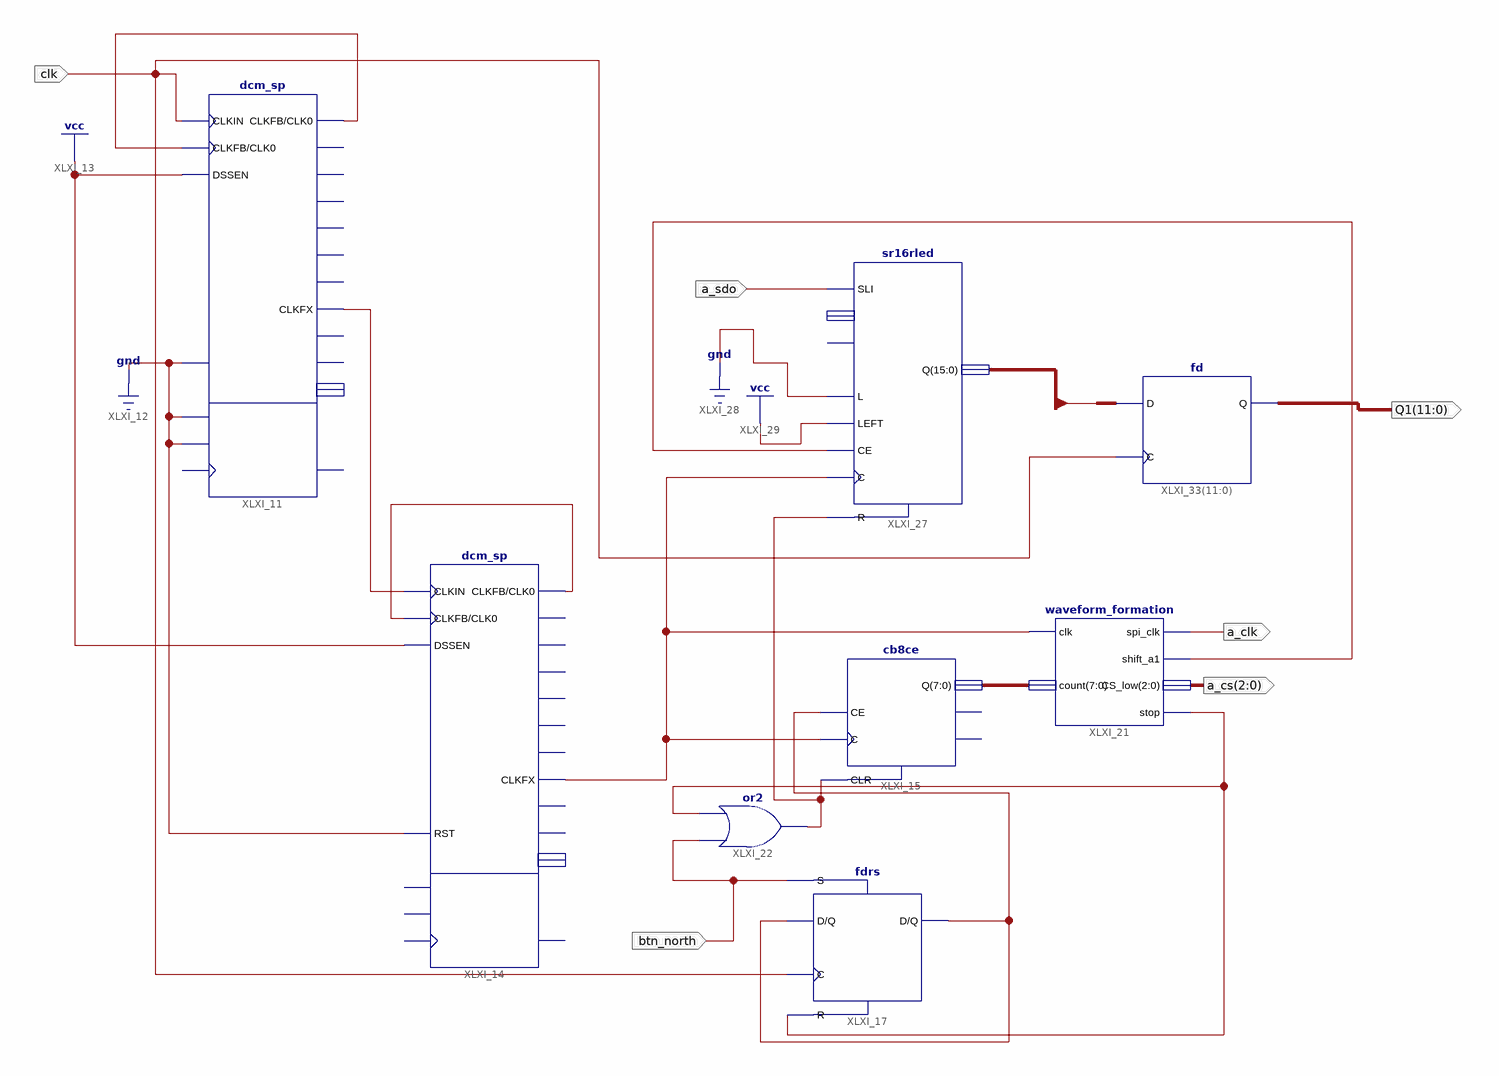
[diagram p0: schematic sheet 1]
// Xilinx ISE schematic main.sch (spartan3e) as structural Verilog: 8 symbols, 6 ports
module main (
  input  clk,
  input  btn_north,
  input  a_sdo,
  output a_clk,
  output [2:0] a_cs,
  output [11:0] Q1
);

  wire led0, XLXN_39, XLXN_65, XLXN_67, XLXN_86, XLXN_90, XLXN_98, XLXN_101;
  wire [7:0] XLXN_84;
  wire [15:0] Q;

  dcm_sp #(.CLKFX_DIVIDE(25)) XLXI_14 (
    .CLKFB(XLXN_67), .CLKIN(XLXN_65), .DSSEN(1'b1), .RST(1'b0), .CLK0(XLXN_67), .CLKFX(XLXN_90));  // open: PSCLK, PSEN, PSINCDEC, CLK180, CLK270, CLK2X, CLK2X180, CLK90, CLKDV, CLKFX180, LOCKED, PSDONE, STATUS
  dcm_sp #(.CLKFX_DIVIDE(20)) XLXI_11 (
    .CLKFB(XLXN_39), .CLKIN(clk), .DSSEN(1'b1), .PSEN(1'b0), .PSINCDEC(1'b0), .RST(1'b0), .CLK0(XLXN_39),
    .CLKFX(XLXN_65));  // open: PSCLK, CLK180, CLK270, CLK2X, CLK2X180, CLK90, CLKDV, CLKFX180, LOCKED, PSDONE, STATUS
  cb8ce XLXI_15 (.C(XLXN_90), .CE(led0), .CLR(XLXN_98), .Q(XLXN_84));  // open: CEO, TC
  fdrs XLXI_17 (.C(clk), .D(led0), .R(XLXN_101), .S(btn_north), .Q(led0));
  waveform_formation XLXI_21 (
    .clk(XLXN_90), .count(XLXN_84), .spi_clk(a_clk), .shift_a1(XLXN_86), .CS_low(a_cs), .stop(XLXN_101));
  or XLXI_22 (XLXN_98, btn_north, XLXN_101);
  sr16rled XLXI_27 (.C(XLXN_90), .CE(XLXN_86), .L(1'b0), .LEFT(1'b1), .R(XLXN_98), .SLI(a_sdo), .Q(Q));  // open: D, SRI
  fd XLXI_33[11:0] (.C(clk), .D(Q[11:0]), .Q(Q1));
endmodule
